# EasyEDA Pro project ProProject_【2023电赛】2023年电赛控制术_2023-08-01.epro, schematic Schematic1

## Sheets
1 单片机: Create Date: 2023-07-21; Page Name: 单片机; Project Name: 【2023电赛】2023年电赛控制术; Schematic Name: Schematic1; Update Date: 2023-07-27; Company: 桂林信息科技学院; Drawed: Jsir2022; Page Size: A4; Reviewed: QQ1171690935; Version: V1
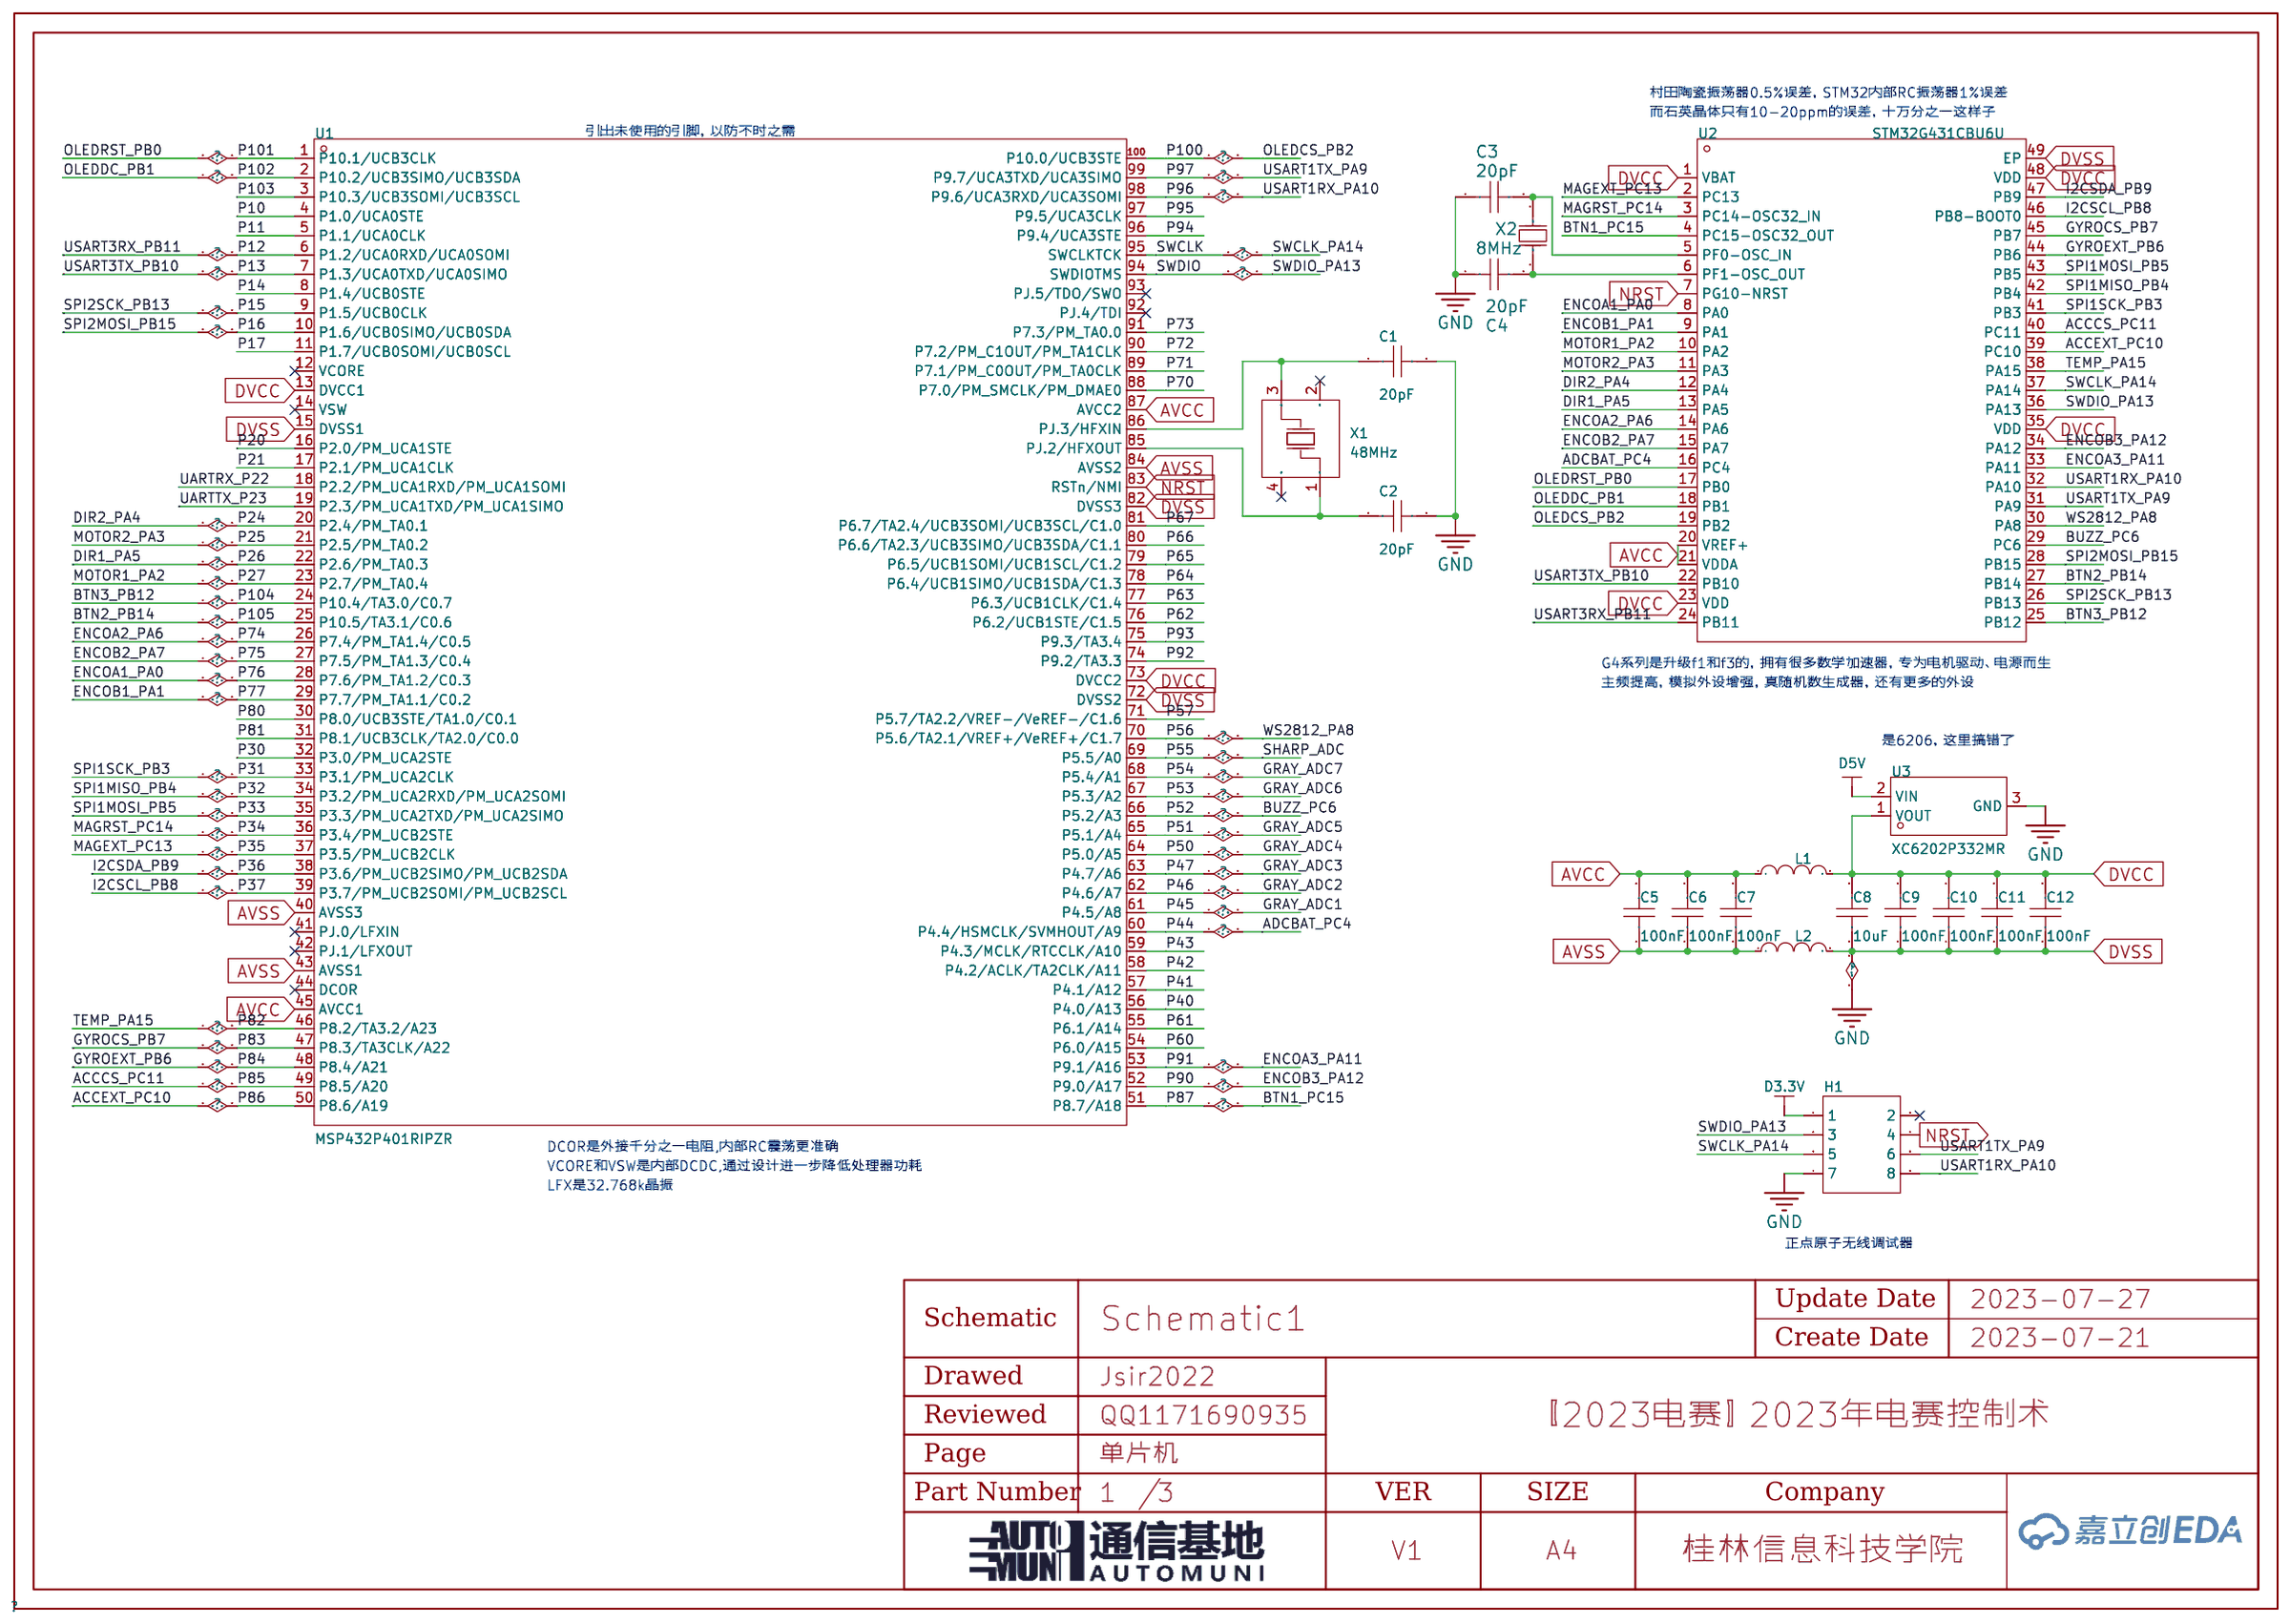
[diagram p1: 单片机]
2 外设: Create Date: 2023-07-22; Page Name: 外设; Update Date: 2023-07-25
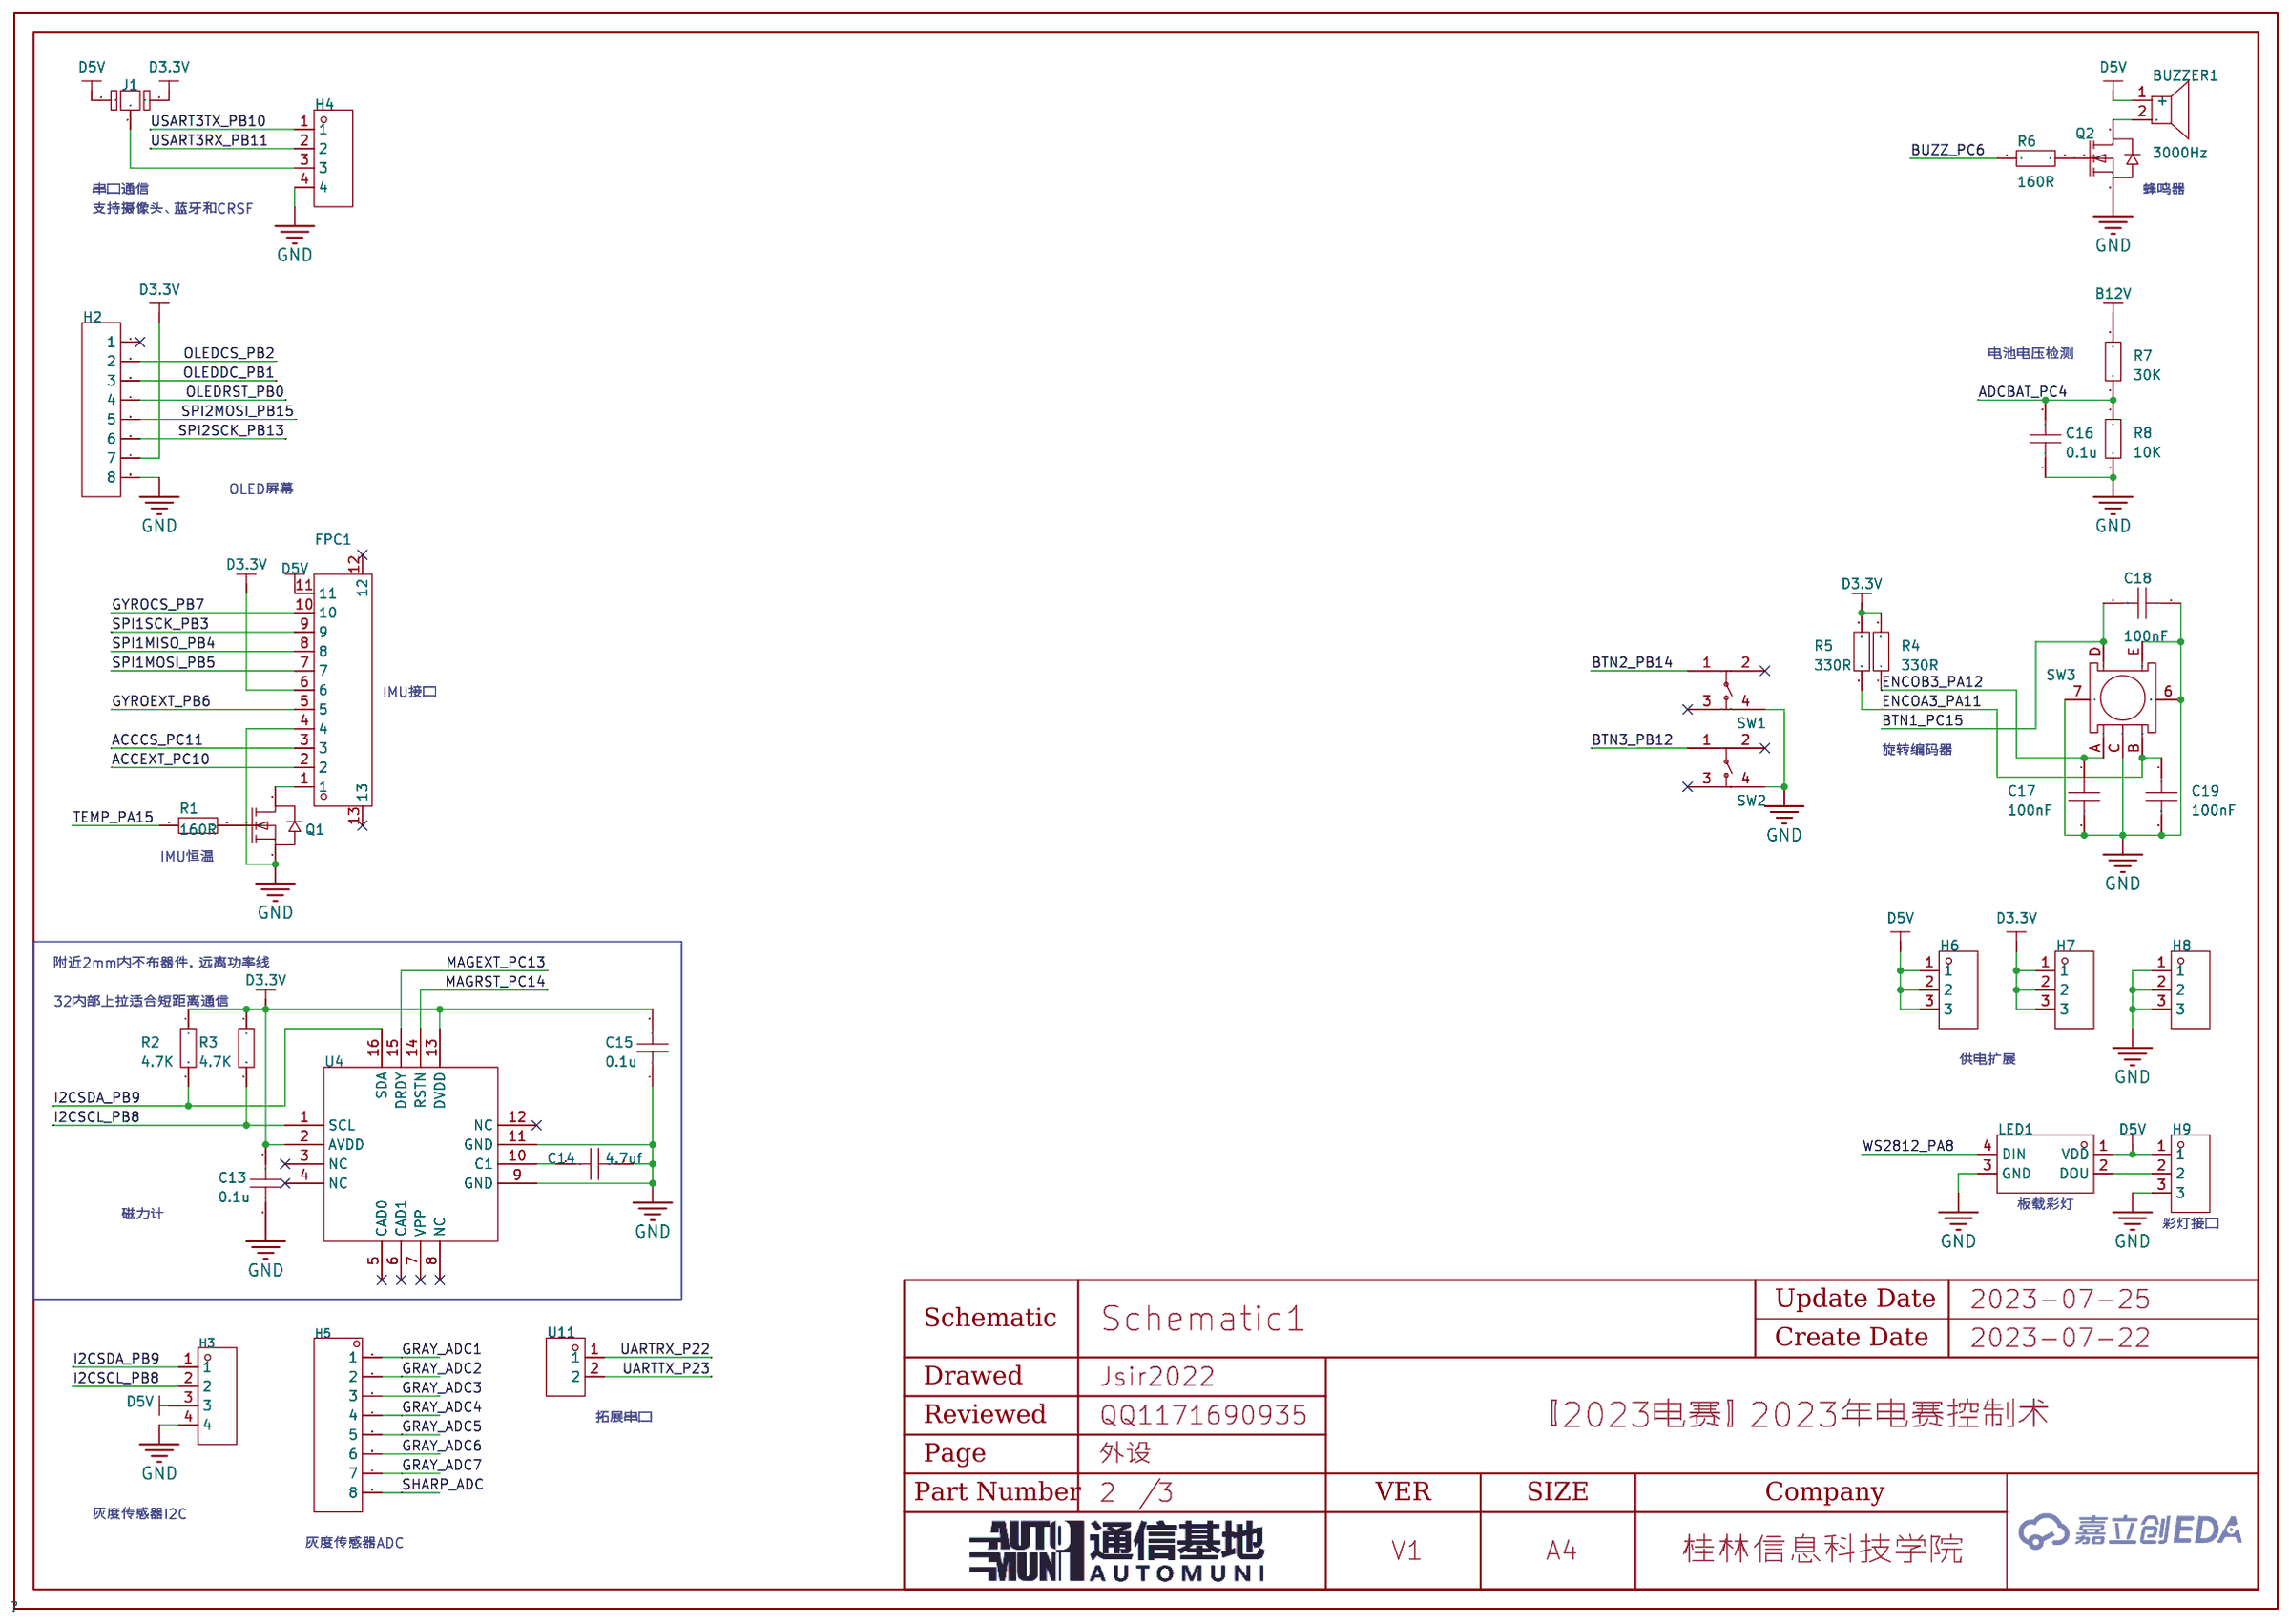
[diagram p2: 外设]
3 电源: Create Date: 2023-07-22; Page Name: 电源; Update Date: 2023-07-23
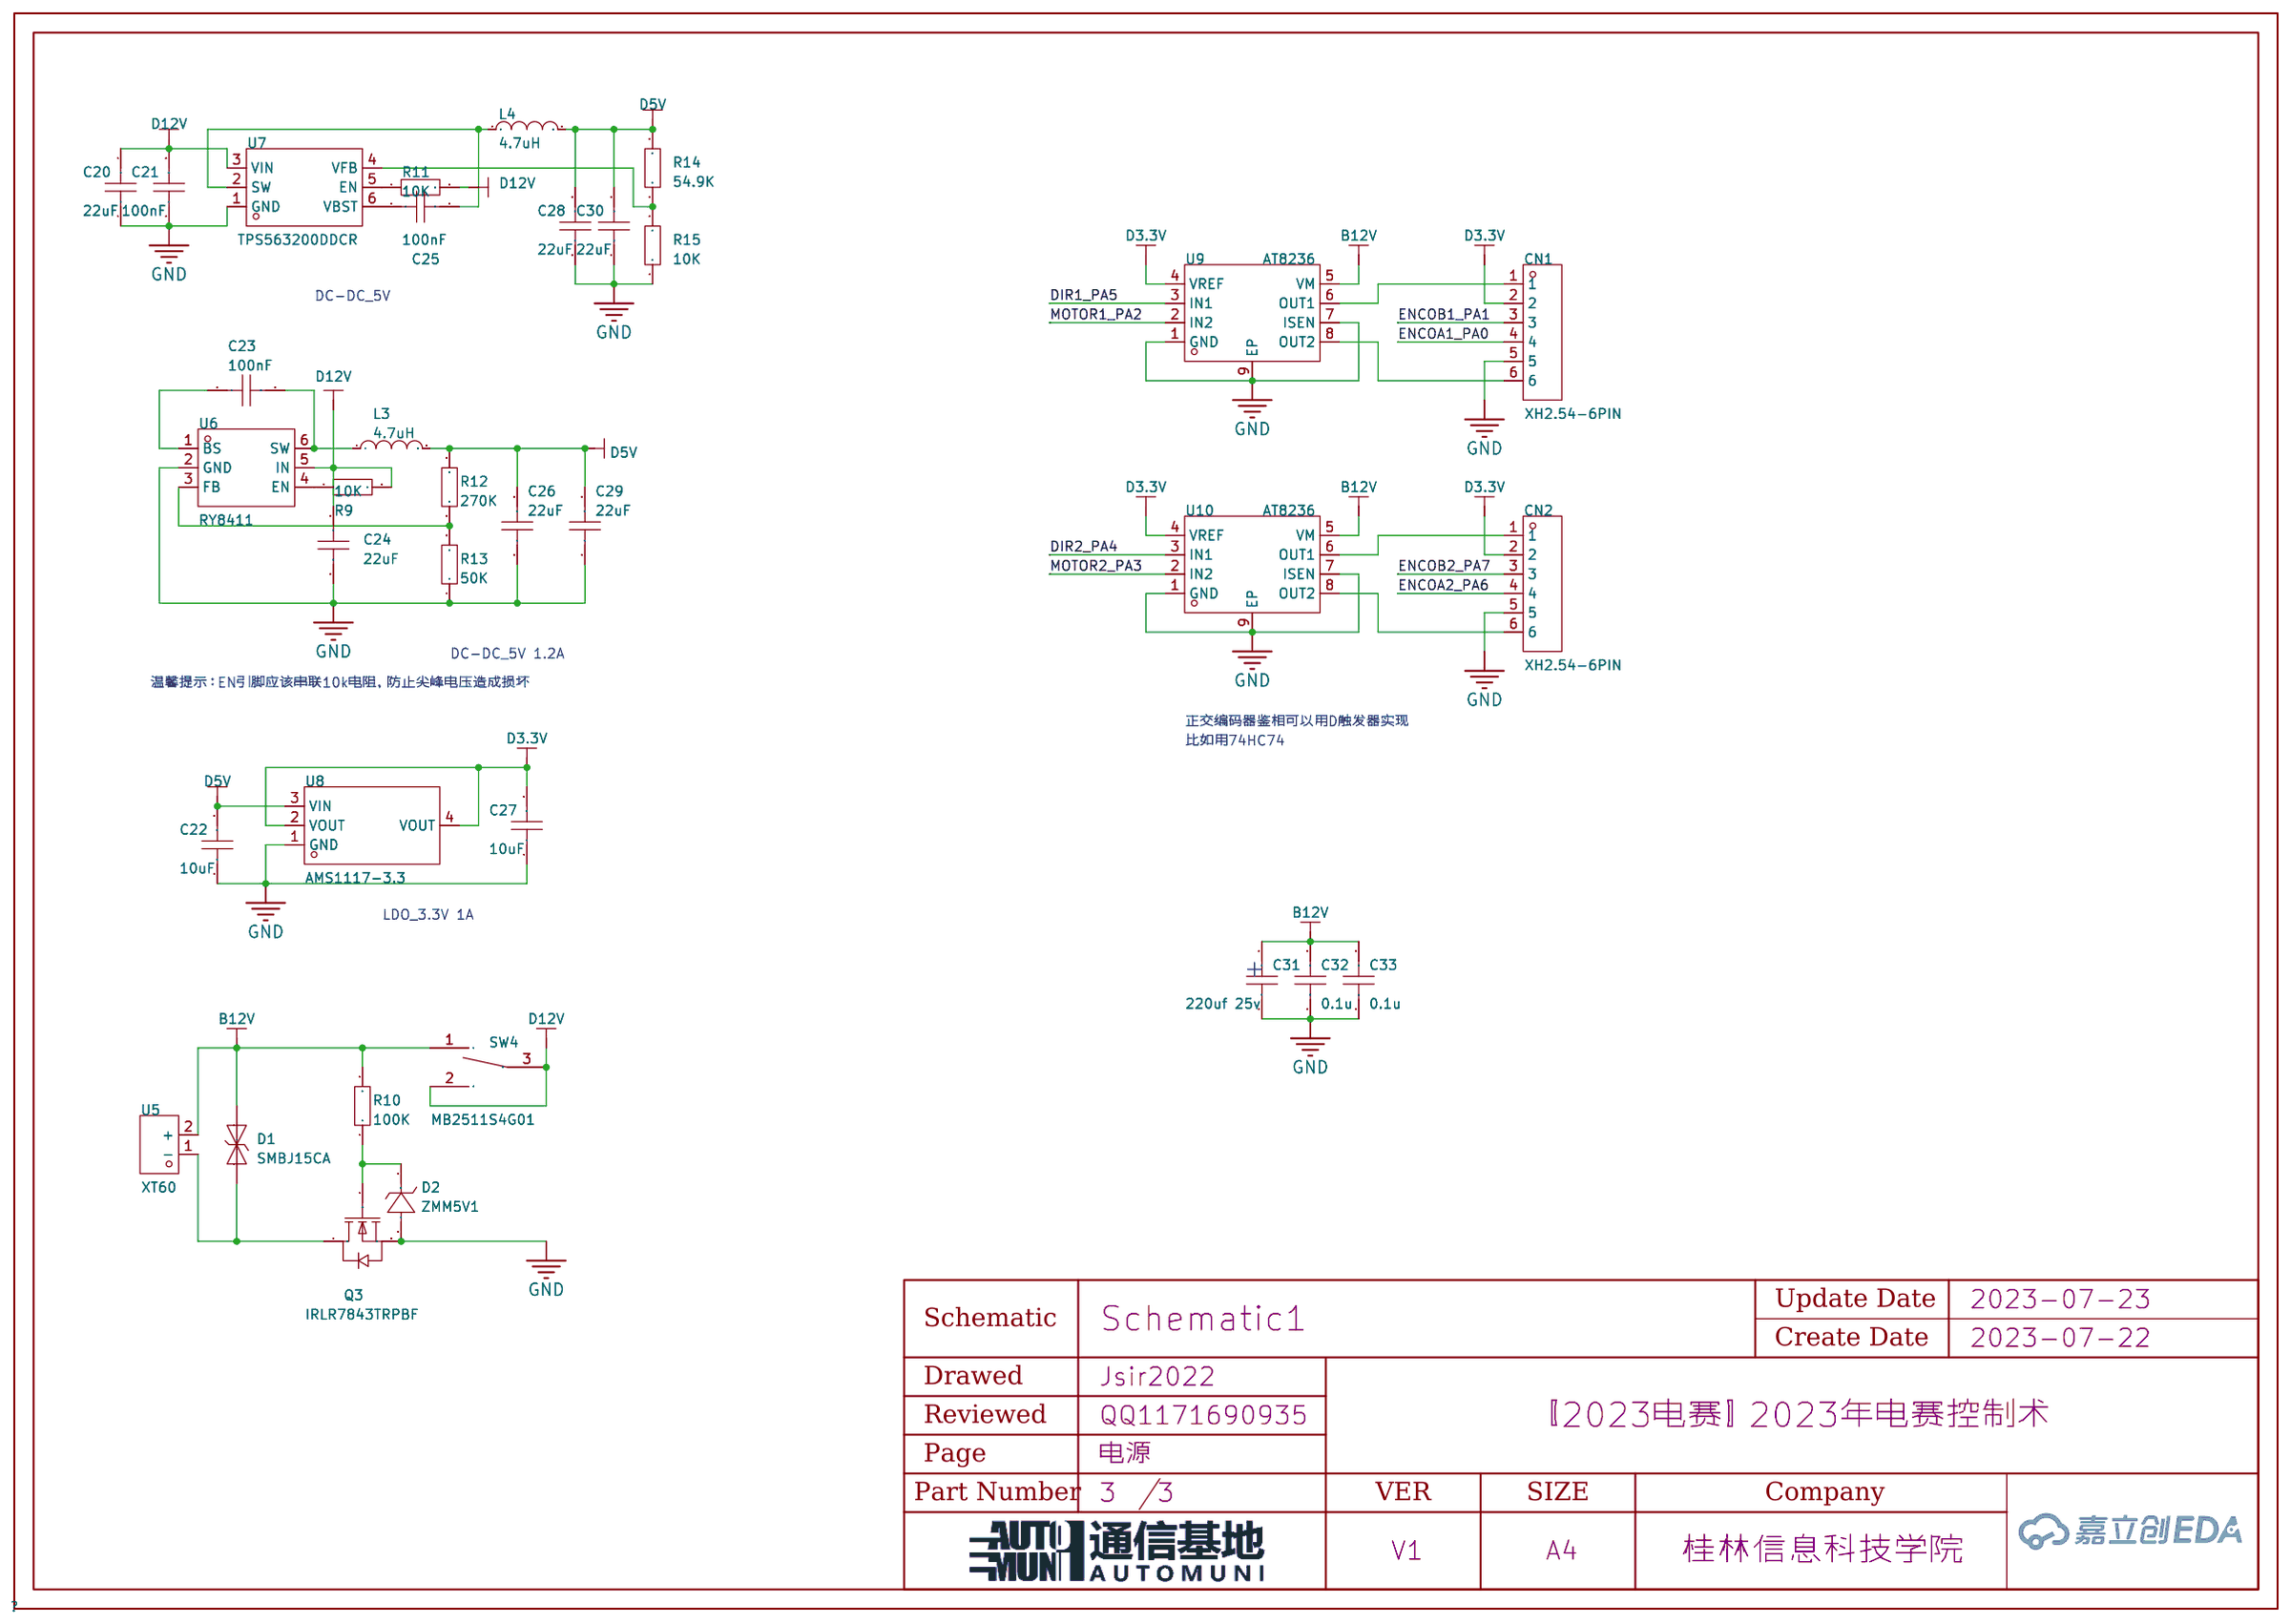
[diagram p3: 电源]

## Parts
sheet 单片机
C1  20pF  [C0603]
C2  20pF  [C0603]
C3  20pF  [C0603]
C4  20pF  [C0603]
C5  100nF  [C0603]
C6  100nF  [C0603]
C7  100nF  [C0603]
C8  10uF  [C0603]
C9  100nF  [C0603]
C10  100nF  [C0603]
C11  100nF  [C0603]
C12  100nF  [C0603]
H1  -  [HDR-TH_8P-P2.54-V-F-R2-C4-S2.54-1]
L1  CBG160808U000T  [L0603]
L2  CBG160808U000T  [L0603]
U1  MSP432P401RIPZR  [QFP-100_L14.0-W14.0-P0.50-LS16.0-BL]
U2  STM32G431CBU6U  [UFQFPN-48_L7.0-W7.0-P0.50-BL-EP5.6]
U3  XC6202P332MR  [SOT-23-3_L2.9-W1.6-P1.90-LS2.8-BR]
X1  48MHz  [CRYSTAL-SMD_4P-L3.2-W2.5-BL]
X2  8MHz  [HC-49SMD_L11.1-W4.8]
sheet 外设
BUZZER1  3000Hz  [BUZ-TH_BD9.6-P5.00-D0.7-FD]
C13  0.1u  [C0603]
C14  4.7uf  [C0603]
C15  0.1u  [C0603]
C16  0.1u  [C0603]
C17  100nF  [C0603]
C18  100nF  [C0603]
C19  100nF  [C0603]
FPC1  0.5K-DX-11PWB  [FPC-SMD_11P-P0.50_DEALON_0.5K-DX-11PWB]
H2  -  [HDR-TH_8P-P2.54-V-F-1]
H3  -  [HDR-TH_4P-P2.54-V-M]
H4  -  [HDR-TH_4P-P2.54-V-M]
H5  -  [HDR-TH_8P-P2.54-V-M]
H6  -  [HDR-TH_3P-P2.54-V-M]
H7  -  [HDR-TH_3P-P2.54-V-M]
H8  -  [HDR-TH_3P-P2.54-V-M]
H9  -  [HDR-TH_3P-P2.54-V-M]
J1  -  [跳线焊盘]
LED1  XL-5050RGBC-WS2812B  [LED-SMD_4P-L5.0-W5.0-BL_XL-5050RGBC]
Q1  FSS2306  [SOT-23-3_L2.9-W1.6-P1.90-LS2.8-BR]
Q2  FSS2306  [SOT-23-3_L2.9-W1.6-P1.90-LS2.8-BR]
R1  160R  [R0603]
R2  4.7K  [R0603]
R3  4.7K  [R0603]
R4  330R  [R0603]
R5  330R  [R0603]
R6  160R  [R0603]
R7  30K  [R0603]
R8  10K  [R0603]
SW1  TS-1089S-AR02516  [SW-SMD_4P-L4.2-W3.3-P2.15-LS5.1]
SW2  TS-1089S-AR02516  [SW-SMD_4P-L4.2-W3.3-P2.15-LS5.1]
SW3  -  [旋转编码器]
U4  -  [VQFN-16_L3.0-W3.0-P0.50-BL-EP1.6]
U11  -  [2.54 2p触点]
sheet 电源
C20  22uF  [C0805]
C21  100nF  [C0603]
C22  10uF  [C0603]
C23  100nF  [C0603]
C24  22uF  [C0805]
C25  100nF  [C0603]
C26  22uF  [C0603]
C27  10uF  [C0603]
C28  22uF  [C0603]
C29  22uF  [C0603]
C30  22uF  [C0603]
C31  220uf 25v  [C1206]
C32  0.1u  [C0603]
C33  0.1u  [C0603]
CN1  XH2.54-6PIN  [CONN-TH_6P-P2.50-V-M_753]
CN2  XH2.54-6PIN  [CONN-TH_6P-P2.50-V-M_753]
D1  SMBJ15CA  [SMB_L4.5-W3.6-LS5.3-BI]
D2  ZMM5V1  [LL-34_L3.5-W1.5-RD]
L3  4.7uH  [IND-SMD_L4.5-W4.0-1]
L4  4.7uH  [IND-SMD_L5.4-W5.2]
Q3  IRLR7843TRPBF  [TO-252-2_L6.5-W6.1-P4.58-LS10.0-TR]
R9  10K  [R0603]
R10  100K  [R0603]
R11  10K  [R0603]
R12  270K  [R0603]
R13  50K  [R0603]
R14  54.9K  [R0603]
R15  10K  [R0603]
SW4  MB2511S4G01  [KEY-TH_MB2511S4G01]
U5  XT60  [CONN-TH_XT60]
U6  RY8411  [SOT-23-6_L2.9-W1.6-P0.95-LS2.8-TL]
U7  TPS563200DDCR  [SOT-23-6_L2.9-W1.6-P0.95-LS2.8-BR]
U8  AMS1117-3.3  [SOT-223-3_L6.5-W3.4-P2.30-LS7.0-BR]
U9  AT8236  [ESOP-8_L4.9-W3.9-P1.27-LS6.0-BL-EP]
U10  AT8236  [ESOP-8_L4.9-W3.9-P1.27-LS6.0-BL-EP]

## Library data of the parts
C1 C2 C5-C19 C21-C23 C25-C30 C32 C33 = CAP_0603: Supplier Footprint: 0603
C3 C4 = 20pF
H1 = HDR-F_2.54_2x4: Supplier Part: C92271; Supplier Footprint: 插件
L1 L2 = CBG160808U000T: 标称阻抗@测试频率:0Ω@100MHz;直流电阻(RDC):100mΩ;; LCSC Part Name: 单路 0603磁珠 阻抗0Ω@100MHz; Supplier Part: C43163; Manufacturer: FH(风华); Supplier Footprint: 0603; JLCPCB Part Class: 扩展库; Datasheet: https://atta.szlcsc.com/upload/public/pdf/source/20151026/1457707503572.pdf; Supplier: LCSC; Impedance @ Frequency: 0Ω@100MHz; DC Resistance: 100mΩ; Current Rating: 800mA; Circuits: 1
U1 = MSP432P401RIPZR: MSP432P401R MSP432P4xx：Falcon 系列; Supplier Part: C80728; Manufacturer: TI(德州仪器); Supplier Footprint: LQFP-100; JLCPCB Part Class: 扩展库; Datasheet: https://atta.szlcsc.com/upload/public/pdf/source/20181012/C80728_0080437A594E8C843952A493687A3A8E.pdf; Supplier: LCSC
U2 = STM32G431CBU6U: CPU内核:ARM Cortex-M4;CPU最大主频:170MHz;程序存储容量:128KB;程序存储器类型:FLASH;RAM总容量:32KB;GPIO端口数量:42;; LCSC Part Name: ARM Cortex-M4 170MHz; Supplier Part: C1341712; Manufacturer: ST(意法半导体); Supplier Footprint: UFQFPN-48(7x7); JLCPCB Part Class: 扩展库; Datasheet: https://atta.szlcsc.com/upload/public/pdf/source/20210607/F3CD0646E5D00AAFDE875C196C2D7333.pdf; Supplier: LCSC; CPU Core: ARM Cortex-M4; CPU Maximum Speed: 170MHz; Operating Voltage Range: 1.71V~3.6V; Program Storage Size: 128KB; Program Memory Type: FLASH; RAM Size: 32KB; GPIO Ports Number: 42; ADC (Bit): 12bit; DAC (Bit): 12bit; Peripheral/Function: PWM；PWM; Internal Oscillator: 有; Operating Temperature Range: -40℃~+85℃
U3 = XC6202P332MR: 输出类型:-;; Supplier Part: C2827634; Manufacturer: TECH PUBLIC(台舟); Supplier Footprint: SOT-23-3L; JLCPCB Part Class: 扩展库; Datasheet: https://atta.szlcsc.com/upload/public/pdf/source/20210427/C2827634_63786C80E55DA743D10E52C7B411F91F.pdf; Supplier: LCSC
X1 = X322548MSB4SI: 频率:48MHz;频率公差:±10ppm;负载电容:20pF;; LCSC Part Name: 48MHz ±10ppm 20pF YSX321SL; Supplier Part: C70579; Manufacturer: YXC(扬兴晶振); Supplier Footprint: SMD3225-4P; JLCPCB Part Class: 扩展库; Datasheet: https://atta.szlcsc.com/upload/public/pdf/source/20210329/C112971_1F611BDC486E193C1706F6D8EB5AA189.pdf; Supplier: LCSC; Crystal Type: 贴片无源晶振; Frequency Tolerance: ±10ppm; Frequency Stability: ±30ppm; Load Capacitance: 20pF; Operating Temperature: -40℃~+85℃
X2 = 49M-008000-FD4D14: Supplier: LCSC; Supplier Part: C470255; Manufacturer: AKER(安碁科技); JLCPCB Part Class: Extended Part
BUZZER1 = HNB09A05: 驱动方式:有源(内含驱动线路);构造类型:电磁式;额定电压:5V;工作电压:4V~8V;频率:3000Hz;声压(SPL):85dB@5V,10cm;直径(φD):9mm;高度:5.7mm;; Supplier Part: C96493; Manufacturer: 华能; Supplier Footprint: 插件; JLCPCB Part Class: Extended Part; Datasheet: https://atta.szlcsc.com/upload/public/pdf/source/20170522/1495448327549.pdf; Supplier: LCSC; Oscillator Circuit: 有源(内含驱动线路); Technology Type: 电磁式; Rated Voltage: 5V; Operating Voltage: 4V~8V; Sound Pressure Level (SPL): 85dB@5V,10cm; Diameter (φD): 9mm; Height: 5.7mm
FPC1 = 0.5K-DX-11PWB: 间距:0.5mm;触点数量:11;锁定特性:翻盖式;安装类型:卧贴;触点类型:下接;工作温度范围:-20℃~+85℃;; LCSC Part Name: 0.5mm P数:11 翻盖式 下接; Supplier Part: C2911837; Manufacturer: HDGC(华德共创); Supplier Footprint: SMD,P=0.5mm; JLCPCB Part Class: Extended Part; Datasheet: https://atta.szlcsc.com/upload/public/pdf/source/20211029/5210AEC837E1AC9B697C39805C1E664F.pdf; Supplier: LCSC; Pitch: 0.5mm; Number of Contacts: 11; Locking Feature: 翻盖式; Mounting Type: 卧贴; Contact Type: 下接; Height Above Board: 2mm; FFC, FCB Thickness: 0.3mm; Operating Temperature Range: -20℃~+85℃
H2 = HDR-F_2.54_1x8P: Supplier Part: C27438; Supplier Footprint: 插件
H3 H4 = HDR-M_2.54_1x4P: Supplier Part: C492403; Supplier Footprint: 插件
H5 = HDR-M_2.54_1x8P: Supplier Part: C124381; Supplier Footprint: 插件
H6-H9 = HDR-M_2.54_1x3P: Supplier Part: C2937625; Supplier Footprint: 插件
J1 = 跳线焊盘3P
LED1 = XL-5050RGBC-WS2812B: 发光颜色:RGB三色;二极管配置:-;主波长:-;色温:-;功率:-;安装方式:正贴;; LCSC Part Name: RGB三色 正贴 幻彩; Supplier Part: C2843785; Manufacturer: XINGLIGHT(成兴光); Supplier Footprint: SMD5050; JLCPCB Part Class: Extended Part; Datasheet: https://atta.szlcsc.com/upload/public/pdf/source/20230111/86AAD2096485A2E5BCAB883FF8CBE6FD.pdf; Supplier: LCSC; Emitted Color: RGB三色; Lens Color: 无色透明; Peak Wavelength: 625nm；470nm；530nm; Viewing Angle: 120°; Mounting Sytle: 正贴; Operating Temperature: -30℃~+70℃
Q1 Q2 = FSS2306: 类型:N沟道;漏源电压(Vdss):20V;连续漏极电流(Id):5A;功率(Pd):1.3W;导通电阻(RDS(on)@Vgs,Id):25mΩ@4.5V,5A;; LCSC Part Name: N沟道 20V 5A; Supplier Part: C2926137; Manufacturer: FOSAN(富信); Supplier Footprint: SOT-23-3L; JLCPCB Part Class: Extended Part; Datasheet: https://atta.szlcsc.com/upload/public/pdf/source/20211206/0662BA7D3D55A2199A8A24CA7CD29DFE.pdf; Supplier: LCSC; Type: N沟道; Drain Source Voltage (Vdss): 20V; Continuous Drain Current (Id): 5A; Power Dissipation (Pd): 1.3W; Drain Source On Resistance (RDS(on)@Vgs,Id): 25mΩ@4.5V,5A; Gate Threshold Voltage (Vgs(th)@Id): 800mV@250uA; Input Capacitance (Ciss@Vds): 820pF@15V; Operating Temperature: +150℃@(Tj)
R1-R15 = Res_0603: Supplier Footprint: 0603
SW1 SW2 = TS-1089S-AR02516: 触点电流:50mA;额定电压(DC):12V;绝缘电阻:100MΩ;电路结构:单刀单掷;安装方式:立贴;按钮形状:椭圆形按钮;按钮/盖帽颜色:白色;作用力:160gf@±50gf;机械寿命:100000;工作温度:-30~+80;引脚样式:SMD接片;开关长度:4.2mm;开关宽度:3.25mm;开关高度:2.5mm;带支架:否;; LCSC Part Name: 342.5 160gf 轻触开关; Supplier Part: C720479; Manufacturer: XUNPU(讯普); Supplier Footprint: SMD; JLCPCB Part Class: Extended Part; Datasheet: https://atta.szlcsc.com/upload/public/pdf/source/20200810/C720479_389650BB8B865DD3822BD59B78D6CF64.pdf; Supplier: LCSC; Contact Current: 50mA; Voltage Rating (DC): 12V; Insulation Resistance: 100MΩ; Circuit: 单刀单掷; Mounting Style: 立贴; Actuator Style: 椭圆形按钮; Actuator/Cap Color: 白色; Operating Force: 160gf@±50gf; Mechanical Life: 100000; Operating Temperature: -30~+80; Pin Style: SMD接片; Switch Length: 4.2mm; Switch Width: 3.25mm; Switch Height: 2.5mm; Strike Gundam: 否
SW3 = EC11E15244B2: Supplier Footprint: 插件
U4 = ist8310
U11 = 2.54 2p触点
C20 C24 = CAP_0805: Supplier Footprint: 0805
C31 = CAP_1206: Supplier Footprint: 1206
CN1 CN2 = XH2.54-6PIN: Supplier Part: C9900014920; Supplier Footprint: JP6; JLCPCB Part Class: Extended Part; Datasheet: https://atta.szlcsc.comnull; Supplier: LCSC
D1 = SMBJ15CA: 极性:双向;反向截止电压(Vrwm):15V;击穿电压(最小值):16.7V;击穿电压(最大值):18.5V;反向漏电流(Ir):1A;峰值脉冲电流(Ipp)@10/1000s:24.6A;最大钳位电压:24.4V;; LCSC Part Name: 双向 Vrwm:15V; Supplier Part: C2920012; Manufacturer: Yint(音特电子); Supplier Footprint: SMB; JLCPCB Part Class: Extended Part; Datasheet: https://atta.szlcsc.com/upload/public/pdf/source/20200115/C484350_0C2E34E4F37DB1425A667172DF3B49D6.pdf; Supplier: LCSC; Polarity: 双向; Reverse Stand-Off Voltage (Vrwm): 15V; Breakdown Voltage (Min): 16.7V; Breakdown Voltage (Max): 18.5V; Reverse Leakage Current (Ir): 1A; Peak Pulse Current (Ipp)@10/1000μs: 24.6A; Maximum Clamping Voltage: 24.4V
D2 = ZMM5V1_C707194: 稳压值(标称值):-;精度:-;功率:500mW;反向电流(Ir):100nA@1V;; LCSC Part Name: 500mW; Supplier Part: C707194; Manufacturer: Slkor(萨科微); Supplier Footprint: LL-34; JLCPCB Part Class: Extended Part; Datasheet: https://atta.szlcsc.com/upload/public/pdf/source/20200721/C707184_776B95022AAA01ECB528B9CFDAFDB27C.pdf; Supplier: LCSC; Power Dissipation: 500mW; Reverse Leakage Current (Ir): 100nA@1V
L3 = MCS0420-4R7MPN2: 电感值:4.7uH;精度:±20%;额定电流:2.2A;饱和电流(Isat):3.5A;; LCSC Part Name: 4.7uH ±20% 2.2A 98mΩ; Supplier Part: C2937092; Manufacturer: PSA(信昌电陶); Supplier Footprint: 0420; JLCPCB Part Class: Extended Part; Datasheet: https://atta.szlcsc.com/upload/public/pdf/source/20220121/BD01ABADD177E465ADC6F87339B1CE90.pdf; Supplier: LCSC; Tolerance: ±20%; Rated Current: 2.2A; Saturation Current (Isat): 3.5A; DC Resistance (DCR): 98mΩ
L4 = MCS0530-4R7MPN2: 电感值:4.7uH;精度:±20%;额定电流:3.5A;饱和电流(Isat):5A;; LCSC Part Name: 4.7uH ±20% 3.5A 50mΩ; Supplier Part: C2937093; Manufacturer: PSA(信昌电陶); Supplier Footprint: 0530; JLCPCB Part Class: Extended Part; Datasheet: https://atta.szlcsc.com/upload/public/pdf/source/20220121/60B00A47E51E3123528D533CA3617FE0.pdf; Supplier: LCSC; Tolerance: ±20%; Rated Current: 3.5A; Saturation Current (Isat): 5A; DC Resistance (DCR): 50mΩ
Q3 = IRLR7843TRPBF_C21988: 类型:N沟道;漏源电压(Vdss):30V;连续漏极电流(Id):161A;功率(Pd):140W;导通电阻(RDS(on)@Vgs,Id):3.3mΩ@10V,15A;阈值电压(Vgs(th)@Id):2.3V@250A;; LCSC Part Name: N沟道 30V 161A; Supplier Part: C21988; Manufacturer: Infineon(英飞凌); Supplier Footprint: TO-252-2(DPAK); JLCPCB Part Class: Extended Part; Datasheet: https://atta.szlcsc.com/upload/public/pdf/source/20140314/1457707013919.pdf; Supplier: LCSC; Type: N沟道; Drain Source Voltage (Vdss): 30V; Continuous Drain Current (Id): 161A; Power Dissipation (Pd): 140W; Drain Source On Resistance (RDS(on)@Vgs,Id): 3.3mΩ@10V,15A; Gate Threshold Voltage (Vgs(th)@Id): 2.3V@250A
SW4 = MB2511S4G01: 触点电流:3A;额定电压 (AC):125V;绝缘电阻:1000MΩ;电路结构:单刀双掷;安装方式:直插;按键形状:圆形按钮;引脚样式:焊片;作用力:2.45N;工作温度:-30~85;机械寿命:200000;; LCSC Part Name: MB-2511G; Supplier Part: C712184; Manufacturer: NKK Switches; Supplier Footprint: 插件; JLCPCB Part Class: Extended Part; Datasheet: https://atta.szlcsc.com/upload/public/pdf/source/20200730/C712184_3135CA9910944615A7155BD78A0CDBC7.pdf; Supplier: LCSC; Contact Current: 3A; Voltage Rating (AC): 125V; Insulation Resistance: 1000MΩ; Circuit: 单刀双掷; Mounting Style: 直插; Actuator Style: 圆形按钮; Pin Style: 焊片; Operating Force: 2.45N; Operating Temperature: -30~85; Mechanical Life: 200000
U5 = XT60: 模型锂电连接器; LCSC Part Name: XT60公头（电调端）; Supplier Part: C98733; Manufacturer: AMASS(艾迈斯); Supplier Footprint: XT60-M; JLCPCB Part Class: Extended Part; Datasheet: https://atta.szlcsc.com/upload/public/pdf/source/20170606/1496716524919.pdf; Supplier: LCSC
U6 = RY8411_C2935411: Supplier Part: C2935411; Manufacturer: RYCHiP(蕊源); Supplier Footprint: SOT-23-6; JLCPCB Part Class: Extended Part; Datasheet: https://atta.szlcsc.com/upload/public/pdf/source/20211220/DB2E518D79CF9F576C855DA4549CDE87.pdf; Supplier: LCSC
U7 = TPS563200DDCR: 功能类型:降压型;同步整流:是;输出类型:可调;输出通道数:1;拓扑结构:降压式;输入电压:4.5V~17V;输出电压:760mV~7V;输出电流(最大值):3A;开关频率:650kHz;工作温度:-40℃~+85℃@(TA);; LCSC Part Name: 降压型 Vin=4.5V~17V Vout=760mV~7V 3A; Supplier Part: C97253; Manufacturer: TI(德州仪器); Supplier Footprint: SOT-23-6; JLCPCB Part Class: Extended Part; Datasheet: https://atta.szlcsc.com/upload/public/pdf/source/20170518/1495086075164.pdf; Supplier: LCSC; Function: 降压型; Synchronous Rectification: 是; Output Type: 可调; Number of Outputs: 1; Topology: 降压式; Input Voltage: 4.5V~17V; Output Voltage: 760mV~7V; Output Current (Max): 3A; Switching Frequency: 650kHz; Operating Temperature: -40℃~+85℃@(TA)
U8 = AMS1117-3.3_C6186: 输出类型:固定;输出极性:正;最大输入电压:-;输出电压:3.3V;输出电流:1A;电源纹波抑制比(PSRR):72dB@(120Hz);; LCSC Part Name: 正 Vout=3.3V 1A 72dB@(120Hz); Supplier Part: C6186; Manufacturer: AMS; Supplier Footprint: SOT-223; JLCPCB Part Class: Basic Part; Datasheet: https://atta.szlcsc.com/upload/public/pdf/source/20180727/C6186_7A095716F0823C02F1997A905E26C086.pdf; Supplier: LCSC; Output Type: 固定; Output Polarity: 正; Number of Outputs: 1; Output Voltage: 3.3V; Dropout Voltage: 1.3V@(800mA); Output Current: 1A; Power Supply Rejection Ratio (PSRR): 72dB@(120Hz)
U9 U10 = AT8236: Supplier Part: C2827823; Manufacturer: 杭州中科微; Supplier Footprint: ESOP-8; JLCPCB Part Class: 扩展库; Datasheet: https://atta.szlcsc.com/upload/public/pdf/source/20210923/1552D95CBAF8BE780D06AE79E7783380.pdf; Supplier: LCSC

## Nets
AVCC: C5.2 C6.2 C7.2 L1.1 U1.45(AVCC1) U1.87(AVCC2) U2.20(VREF+) U2.21(VDDA)
AVSS: C5.1 C6.1 C7.1 L2.1 U1.40(AVSS3) U1.43(AVSS1) U1.84(AVSS2)
D3.3V: C13.1 C15.2 C27.2 CN1.2 CN2.2 FPC1.6 H1.1 H2.7 H7.1 H7.2 H7.3 J1.3 R2.1 R3.1 R4.2 R5.2 U4.2(AVDD) U4.13(DVDD) U8.2(VOUT) U8.4(VOUT) U9.4(VREF) U10.4(VREF)
D5V: BUZZER1.1(+) C22.2 C26.2 C28.2 C29.2 C30.2 FPC1.11 H3.3 H6.1 H6.2 H6.3 H9.1 J1.2 L3.2 L4.2 LED1.1(VDD) R12.2 R14.2 U3.2(VIN) U8.3(VIN)
D12V: C20.2 C21.2 C24.2 R9.2 R11.2 SW4.2 SW4.3 U6.5(IN) U7.3(VIN)
DVCC: C8.2 C9.2 C10.2 C11.2 C12.2 L1.2 U1.13(DVCC1) U1.73(DVCC2) U2.1(VBAT) U2.23(VDD) U2.35(VDD) U2.48(VDD) U3.1(VOUT)
GND: C1.2 C2.2 C3.1 C4.1 C8.1 C9.1 C10.1 C11.1 C12.1 C13.2 C14.2 C15.1 C16.1 C17.2 C18.1 C19.2 C20.1 C21.1 C22.1 C24.1 C26.1 C27.1 C28.1 C29.1 C30.1 C31.1 C32.1 C33.1 CN1.5 CN2.5 D2.2(A) FPC1.4 H1.7 H2.8 H3.4 H4.4 H8.1 H8.2 H8.3 H9.3 L2.2 LED1.3(GND) Q1.2(S) Q2.2(S) Q3.3(S) R8.1 R13.1 R15.1 SW1.4 SW2.4 SW3.6 SW3.7 SW3.C SW3.E U1.15(DVSS1) U1.72(DVSS2) U1.82(DVSS3) U2.49(EP) U3.3(GND) U4.9(GND) U4.11(GND) U6.2(GND) U7.1(GND) U8.1(GND) U9.1(GND) U9.7(ISEN) U9.9(EP) U10.1(GND) U10.7(ISEN) U10.9(EP)
ACCCS_PC11: FPC1.3 U1.49(P8.5/A20) U2.40(PC11)
ACCEXT_PC10: FPC1.2 U1.50(P8.6/A19) U2.39(PC10)
ADCBAT_PC4: C16.2 R7.1 R8.2 U1.60(P4.4/HSMCLK/SVMHOUT/A9) U2.16(PC4)
B12V: C31.2 C32.2 C33.2 D1.1(K) R7.2 R10.2 SW4.1 U5.2(+) U9.5(VM) U10.5(VM)
BTN1_PC15: C18.2 SW3.D U1.51(P8.7/A18) U2.4(PC15-OSC32_OUT)
BTN2_PB14: SW1.1 U1.25(P10.5/TA3.1/C0.6) U2.27(PB14)
BTN3_PB12: SW2.1 U1.24(P10.4/TA3.0/C0.7) U2.25(PB12)
BUZZ_PC6: R6.1 U1.66(P5.2/A3) U2.29(PC6)
DIR1_PA5: U1.22(P2.6/PM_TA0.3) U2.13(PA5) U9.3(IN1)
DIR2_PA4: U1.20(P2.4/PM_TA0.1) U2.12(PA4) U10.3(IN1)
ENCOA1_PA0: CN1.4 U1.28(P7.6/PM_TA1.2/C0.3) U2.8(PA0)
ENCOA2_PA6: CN2.4 U1.26(P7.4/PM_TA1.4/C0.5) U2.14(PA6)
ENCOA3_PA11: C19.1 R5.1 SW3.B U1.53(P9.1/A16) U2.33(PA11)
ENCOB1_PA1: CN1.3 U1.29(P7.7/PM_TA1.1/C0.2) U2.9(PA1)
ENCOB2_PA7: CN2.3 U1.27(P7.5/PM_TA1.3/C0.4) U2.15(PA7)
ENCOB3_PA12: C17.1 R4.1 SW3.A U1.52(P9.0/A17) U2.34(PA12)
GRAY_ADC1: H5.1 U1.61(P4.5/A8)
GRAY_ADC2: H5.2 U1.62(P4.6/A7)
GRAY_ADC3: H5.3 U1.63(P4.7/A6)
GRAY_ADC4: H5.4 U1.64(P5.0/A5)
GRAY_ADC5: H5.5 U1.65(P5.1/A4)
GRAY_ADC6: H5.6 U1.67(P5.3/A2)
GRAY_ADC7: H5.7 U1.68(P5.4/A1)
GYROCS_PB7: FPC1.10 U1.47(P8.3/TA3CLK/A22) U2.45(PB7)
GYROEXT_PB6: FPC1.5 U1.48(P8.4/A21) U2.44(PB6)
I2CSCL_PB8: H3.2 R3.2 U1.39(P3.7/PM_UCB2SOMI/PM_UCB2SCL) U2.46(PB8-BOOT0) U4.1(SCL)
I2CSDA_PB9: H3.1 R2.2 U1.38(P3.6/PM_UCB2SIMO/PM_UCB2SDA) U2.47(PB9) U4.16(SDA)
MAGEXT_PC13: U1.37(P3.5/PM_UCB2CLK) U2.2(PC13) U4.15(DRDY)
MAGRST_PC14: U1.36(P3.4/PM_UCB2STE) U2.3(PC14-OSC32_IN) U4.14(RSTN)
MOTOR1_PA2: U1.23(P2.7/PM_TA0.4) U2.10(PA2) U9.2(IN2)
MOTOR2_PA3: U1.21(P2.5/PM_TA0.2) U2.11(PA3) U10.2(IN2)
NRST: H1.4 U1.83(RSTn/NMI) U2.7(PG10-NRST)
OLEDCS_PB2: H2.2 U1.100(P10.0/UCB3STE) U2.19(PB2)
OLEDDC_PB1: H2.3 U1.2(P10.2/UCB3SIMO/UCB3SDA) U2.18(PB1)
OLEDRST_PB0: H2.4 U1.1(P10.1/UCB3CLK) U2.17(PB0)
P10: U1.4(P1.0/UCA0STE)
P11: U1.5(P1.1/UCA0CLK)
P12: H4.2 U1.6(P1.2/UCA0RXD/UCA0SOMI) U2.24(PB11)
P13: H4.1 U1.7(P1.3/UCA0TXD/UCA0SIMO) U2.22(PB10)
P14: U1.8(P1.4/UCB0STE)
P15: H2.6 U1.9(P1.5/UCB0CLK) U2.26(PB13)
P16: H2.5 U1.10(P1.6/UCB0SIMO/UCB0SDA) U2.28(PB15)
P17: U1.11(P1.7/UCB0SOMI/UCB0SCL)
P20: U1.16(P2.0/PM_UCA1STE)
P21: U1.17(P2.1/PM_UCA1CLK)
P30: U1.32(P3.0/PM_UCA2STE)
P31: FPC1.9 U1.33(P3.1/PM_UCA2CLK) U2.41(PB3)
P32: FPC1.8 U1.34(P3.2/PM_UCA2RXD/PM_UCA2SOMI) U2.42(PB4)
P33: FPC1.7 U1.35(P3.3/PM_UCA2TXD/PM_UCA2SIMO) U2.43(PB5)
P40: U1.56(P4.0/A13)
P41: U1.57(P4.1/A12)
P42: U1.58(P4.2/ACLK/TA2CLK/A11)
P43: U1.59(P4.3/MCLK/RTCCLK/A10)
P55: H5.8 U1.69(P5.5/A0)
P56: LED1.4(DIN) U1.70(P5.6/TA2.1/VREF+/VeREF+/C1.7) U2.30(PA8)
P57: U1.71(P5.7/TA2.2/VREF-/VeREF-/C1.6)
P60: U1.54(P6.0/A15)
P61: U1.55(P6.1/A14)
P62: U1.76(P6.2/UCB1STE/C1.5)
P63: U1.77(P6.3/UCB1CLK/C1.4)
P64: U1.78(P6.4/UCB1SIMO/UCB1SDA/C1.3)
P65: U1.79(P6.5/UCB1SOMI/UCB1SCL/C1.2)
P66: U1.80(P6.6/TA2.3/UCB3SIMO/UCB3SDA/C1.1)
P67: U1.81(P6.7/TA2.4/UCB3SOMI/UCB3SCL/C1.0)
P70: U1.88(P7.0/PM_SMCLK/PM_DMAE0)
P71: U1.89(P7.1/PM_C0OUT/PM_TA0CLK)
P72: U1.90(P7.2/PM_C1OUT/PM_TA1CLK)
P73: U1.91(P7.3/PM_TA0.0)
P80: U1.30(P8.0/UCB3STE/TA1.0/C0.1)
P81: U1.31(P8.1/UCB3CLK/TA2.0/C0.0)
P82: R1.1 U1.46(P8.2/TA3.2/A23) U2.38(PA15)
P92: U1.74(P9.2/TA3.3)
P93: U1.75(P9.3/TA3.4)
P94: U1.96(P9.4/UCA3STE)
P95: U1.97(P9.5/UCA3CLK)
P96: H1.8 U1.98(P9.6/UCA3RXD/UCA3SOMI) U2.32(PA10)
P97: H1.6 U1.99(P9.7/UCA3TXD/UCA3SIMO) U2.31(PA9)
P103: U1.3(P10.3/UCB3SOMI/UCB3SCL)
SWCLK: H1.5 U1.95(SWCLKTCK) U2.37(PA14)
SWDIO: H1.3 U1.94(SWDIOTMS) U2.36(PA13)
UARTRX_P22: U1.18(P2.2/PM_UCA1RXD/PM_UCA1SOMI) U11.1
UARTTX_P23: U1.19(P2.3/PM_UCA1TXD/PM_UCA1SIMO) U11.2
$1N8123: C4.2 U2.6(PF1-OSC_OUT) X2.2(OSC2)
$1N8134: C3.2 U2.5(PF0-OSC_IN) X2.1(OSC1)
$1N11130: C1.1 U1.86(PJ.3/HFXIN) X1.3(OSC2)
$1N11324: C2.1 U1.85(PJ.2/HFXOUT) X1.1(OSC1)
$2N128: H4.3 J1.1
$2N378: BUZZER1.2 Q2.3(D)
$2N380: Q2.1(G) R6.2
$2N829: FPC1.1 Q1.3(D)
$2N830: Q1.1(G) R1.2
$2N1066: C14.1 U4.10(C1)
$2N4188: H9.2 LED1.2(DOU)
$3N440: C23.1 U6.1(BS)
$3N441: C23.2 L3.1 U6.6(SW)
$3N443: R12.1 R13.2 U6.3(FB)
$3N445: R9.1 U6.4(EN)
$3N604: CN1.1 U9.6(OUT1)
$3N605: CN1.6 U9.8(OUT2)
$3N842: D2.1(C) Q3.1(G) R10.1
$3N843: D1.2(A) Q3.4(D) U5.1(-)
$3N2408: CN2.1 U10.6(OUT1)
$3N2409: CN2.6 U10.8(OUT2)
$3N3836: C25.2 L4.1 U7.2(SW)
$3N3839: R14.1 R15.2 U7.4(VFB)
$3N3841: C25.1 U7.6(VBST)
$3N4184: R11.1 U7.5(EN)

Not connected (* = marked no-connect by the designer): FPC1 12* 13*; H1 2*; H2 1*; SW1 2* 3*; SW2 2* 3*; U1 12(VCORE)* 14(VSW)* 41(PJ.0/LFXIN)* 42(PJ.1/LFXOUT)* 44(DCOR)* 92(PJ.4/TDI)* 93(PJ.5/TDO/SWO)*; U4 3(NC)* 4(NC)* 5(CAD0)* 6(CAD1)* 7(VPP)* 8(NC)* 12(NC)*; X1 2(GND)* 4(GND)*

## Notes on the sheets
sheet 1
- 村田陶瓷振荡器0.5%误差，STM32内部RC振荡器1%误差
- 而石英晶体只有10-20ppm的误差，十万分之一这样子
- 引出未使用的引脚，以防不时之需
- G4系列是升级f1和f3的，拥有很多数学加速器，专为电机驱动、电源而生
- 主频提高，模拟外设增强，真随机数生成器，还有更多的外设
- 是6206，这里搞错了
- DCOR是外接千分之一电阻,内部RC震荡更准确
- VCORE和VSW是内部DCDC,通过设计进一步降低处理器功耗
- LFX是32.768k晶振
- 正点原子无线调试器
sheet 2
- 串口通信
- 蜂鸣器
- 支持摄像头、蓝牙和CRSF
- 电池电压检测
- OLED屏幕
- IMU接口
- 旋转编码器
- IMU恒温
- 附近2mm内不布器件，远离功率线
- 32内部上拉适合短距离通信
- 供电扩展
- 板载彩灯
- 磁力计
- 彩灯接口
- 拓展串口
- 灰度传感器I2C
- 灰度传感器ADC
sheet 3
- DC-DC_5V
- DC-DC_5V 1.2A
- 温馨提示：EN引脚应该串联10k电阻，防止尖峰电压造成损坏
- 正交编码器鉴相可以用D触发器实现
- 比如用74HC74
- LDO_3.3V 1A
- +
